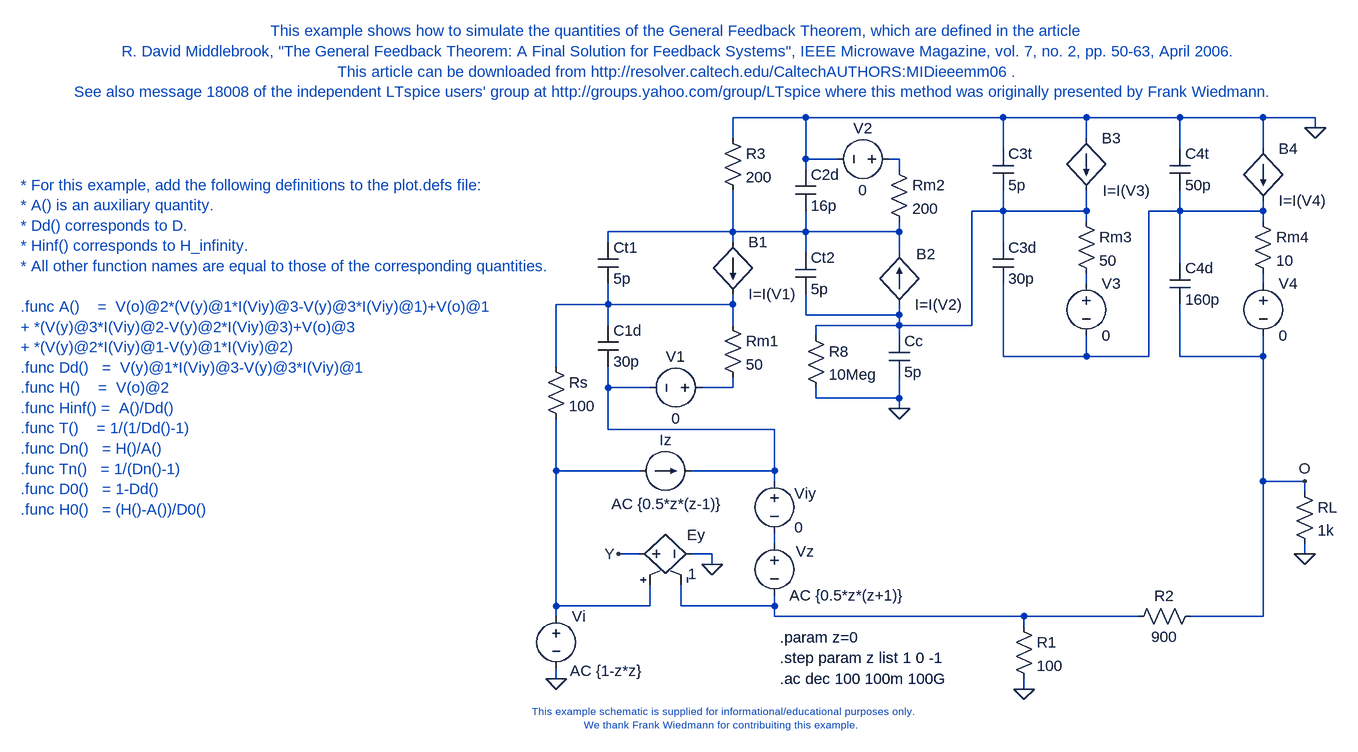
[diagram p0: schematic GFT2.asc]
GFT2.asc, the LTspice schematic file:
Version 4
SHEET 1 2208 680
WIRE 272 -848 160 -848
WIRE 576 -848 272 -848
WIRE 704 -848 576 -848
WIRE 848 -848 704 -848
WIRE 976 -848 848 -848
WIRE 1056 -848 976 -848
WIRE 1056 -832 1056 -848
WIRE 160 -816 160 -848
WIRE 704 -816 704 -848
WIRE 576 -800 576 -848
WIRE 848 -800 848 -848
WIRE 976 -800 976 -848
WIRE 272 -784 272 -848
WIRE 320 -784 272 -784
WIRE 416 -784 400 -784
WIRE 272 -768 272 -784
WIRE 416 -768 416 -784
WIRE 576 -704 576 -736
WIRE 576 -704 528 -704
WIRE 704 -704 704 -736
WIRE 704 -704 576 -704
WIRE 848 -704 848 -736
WIRE 848 -704 800 -704
WIRE 976 -704 976 -720
WIRE 976 -704 848 -704
WIRE 704 -688 704 -704
WIRE 976 -688 976 -704
WIRE 160 -672 160 -736
WIRE 160 -672 -32 -672
WIRE 272 -672 272 -704
WIRE 272 -672 160 -672
WIRE 416 -672 416 -688
WIRE 416 -672 272 -672
WIRE -32 -656 -32 -672
WIRE 160 -656 160 -672
WIRE 576 -656 576 -704
WIRE 272 -640 272 -672
WIRE 416 -640 416 -672
WIRE 848 -624 848 -704
WIRE 704 -592 704 -608
WIRE 976 -592 976 -608
WIRE -32 -560 -32 -592
WIRE -32 -560 -112 -560
WIRE 160 -560 160 -576
WIRE 160 -560 -32 -560
WIRE 272 -544 272 -576
WIRE 416 -544 416 -560
WIRE 416 -544 272 -544
WIRE -32 -528 -32 -560
WIRE 160 -528 160 -560
WIRE 416 -528 416 -544
WIRE 416 -528 288 -528
WIRE 528 -528 528 -704
WIRE 528 -528 416 -528
WIRE 288 -512 288 -528
WIRE 416 -512 416 -528
WIRE 576 -480 576 -592
WIRE 704 -480 704 -512
WIRE 704 -480 576 -480
WIRE 800 -480 800 -704
WIRE 800 -480 704 -480
WIRE 848 -480 848 -560
WIRE 976 -480 976 -512
WIRE 976 -480 848 -480
WIRE -112 -464 -112 -560
WIRE -32 -432 -32 -464
WIRE 32 -432 -32 -432
WIRE 160 -432 160 -448
WIRE 160 -432 112 -432
WIRE 288 -416 288 -432
WIRE 416 -416 416 -448
WIRE 416 -416 288 -416
WIRE 416 -400 416 -416
WIRE -32 -368 -32 -432
WIRE 224 -368 -32 -368
WIRE -112 -304 -112 -384
WIRE 16 -304 -112 -304
WIRE 224 -304 224 -368
WIRE 224 -304 96 -304
WIRE 224 -288 224 -304
WIRE 976 -288 976 -480
WIRE 1040 -288 976 -288
WIRE 1040 -272 1040 -288
WIRE 224 -192 224 -208
WIRE 16 -176 -16 -176
WIRE 128 -176 96 -176
WIRE 1040 -176 1040 -192
WIRE 128 -160 128 -176
WIRE -112 -96 -112 -304
WIRE 32 -96 32 -128
WIRE 32 -96 -112 -96
WIRE 80 -96 80 -128
WIRE 224 -96 224 -112
WIRE 224 -96 80 -96
WIRE -112 -80 -112 -96
WIRE 224 -80 224 -96
WIRE 608 -80 224 -80
WIRE 784 -80 608 -80
WIRE 976 -80 976 -288
WIRE 976 -80 864 -80
WIRE 608 -64 608 -80
WIRE -112 16 -112 0
WIRE 608 32 608 16
FLAG -112 16 0
FLAG 128 -160 0
FLAG -16 -176 Y
FLAG 416 -400 0
FLAG 1056 -832 0
FLAG 608 32 0
FLAG 1040 -176 0
FLAG 1040 -288 O
SYMBOL voltage -112 -96 R0
WINDOW 123 21 100 Left 2
WINDOW 39 0 0 Left 2
SYMATTR Value2 AC {1-z*z}
SYMATTR InstName Vi
SYMATTR Value ""
SYMBOL current 16 -304 R270
WINDOW 0 32 40 VTop 2
WINDOW 3 -32 40 VBottom 2
WINDOW 123 -35 42 VBottom 2
WINDOW 39 0 0 Left 2
SYMATTR InstName Iz
SYMATTR Value ""
SYMATTR Value2 AC {0.5*z*(z-1)}
SYMBOL voltage 224 -304 R0
WINDOW 123 0 0 Left 2
WINDOW 39 0 0 Left 2
WINDOW 3 31 87 Left 2
WINDOW 0 31 35 Left 2
SYMATTR Value 0
SYMATTR InstName Viy
SYMBOL voltage 224 -208 R0
WINDOW 123 23 96 Left 2
WINDOW 39 0 0 Left 2
WINDOW 0 33 28 Left 2
SYMATTR Value2 AC {0.5*z*(z+1)}
SYMATTR InstName Vz
SYMATTR Value ""
SYMBOL e 0 -176 R270
WINDOW 0 29 89 VRight 2
WINDOW 3 -31 91 VRight 2
SYMATTR InstName Ey
SYMATTR Value 1
SYMBOL res -128 -480 R0
SYMATTR InstName Rs
SYMATTR Value 100
SYMBOL voltage 128 -432 R90
WINDOW 0 -32 56 VBottom 2
WINDOW 3 32 56 VTop 2
WINDOW 123 32 56 VTop 2
WINDOW 39 32 56 VTop 2
SYMATTR InstName V1
SYMATTR Value 0
SYMBOL cap -48 -528 R0
SYMATTR InstName C1d
SYMATTR Value 30p
SYMBOL res 144 -544 R0
SYMATTR InstName Rm1
SYMATTR Value 50
SYMBOL cap -48 -656 R0
SYMATTR InstName Ct1
SYMATTR Value 5p
SYMBOL bi 160 -656 R0
SYMATTR InstName B1
SYMATTR Value I=I(V1)
SYMBOL res 144 -832 R0
SYMATTR InstName R3
SYMATTR Value 200
SYMBOL cap 256 -768 R0
SYMATTR InstName C2d
SYMATTR Value 16p
SYMBOL voltage 416 -784 R90
WINDOW 0 -32 56 VBottom 2
WINDOW 3 32 56 VTop 2
WINDOW 123 32 56 VTop 2
WINDOW 39 32 56 VTop 2
SYMATTR InstName V2
SYMATTR Value 0
SYMBOL res 400 -784 R0
SYMATTR InstName Rm2
SYMATTR Value 200
SYMBOL cap 256 -640 R0
SYMATTR InstName Ct2
SYMATTR Value 5p
SYMBOL bi 416 -560 M180
WINDOW 0 26 78 Left 2
WINDOW 3 24 0 Left 2
SYMATTR InstName B2
SYMATTR Value I=I(V2)
SYMBOL cap 400 -512 R0
SYMATTR InstName Cc
SYMATTR Value 5p
SYMBOL res 272 -528 R0
SYMATTR InstName R8
SYMATTR Value 10Meg
SYMBOL cap 560 -800 R0
SYMATTR InstName C3t
SYMATTR Value 5p
SYMBOL bi 704 -816 R0
WINDOW 3 25 81 Left 2
SYMATTR Value I=I(V3)
SYMATTR InstName B3
SYMBOL cap 560 -656 R0
SYMATTR InstName C3d
SYMATTR Value 30p
SYMBOL res 688 -704 R0
SYMATTR InstName Rm3
SYMATTR Value 50
SYMBOL voltage 704 -608 R0
WINDOW 123 0 0 Left 2
WINDOW 39 0 0 Left 2
SYMATTR Value 0
SYMATTR InstName V3
SYMBOL cap 832 -800 R0
SYMATTR InstName C4t
SYMATTR Value 50p
SYMBOL bi 976 -800 R0
SYMATTR InstName B4
SYMATTR Value I=I(V4)
SYMBOL cap 832 -624 R0
SYMATTR InstName C4d
SYMATTR Value 160p
SYMBOL res 960 -704 R0
SYMATTR InstName Rm4
SYMATTR Value 10
SYMBOL voltage 976 -608 R0
WINDOW 123 0 0 Left 2
WINDOW 39 0 0 Left 2
SYMATTR Value 0
SYMATTR InstName V4
SYMBOL res 592 -80 R0
SYMATTR InstName R1
SYMATTR Value 100
SYMBOL res 880 -96 R90
WINDOW 0 0 56 VBottom 2
WINDOW 3 32 56 VTop 2
SYMATTR InstName R2
SYMATTR Value 900
SYMBOL res 1024 -288 R0
SYMATTR InstName RL
SYMATTR Value 1k
TEXT 232 16 Left 2 !.ac dec 100 100m 100G
TEXT 232 -48 Left 2 !.param z=0
TEXT 232 -16 Left 2 !.step param z list 1 0 -1
TEXT 136 56 Top 1 ;This example schematic is supplied for informational/educational purposes only.\nWe thank Frank Wiedmann for contribuiting this example.
TEXT 80 -872 Bottom 2 ;This example shows how to simulate the quantities of the General Feedback Theorem, which are defined in the article\n R. David Middlebrook, "The General Feedback Theorem: A Final Solution for Feedback Systems", IEEE Microwave Magazine, vol. 7, no. 2, pp. 50-63, April 2006.\nThis article can be downloaded from http://resolver.caltech.edu/CaltechAUTHORS:MIDieeemm06 .\nSee also message 18008 of the independent LTspice users' group at http://groups.yahoo.com/group/LTspice where this method was originally presented by Frank Wiedmann.
TEXT -936 -744 Left 2 ;* For this example, add the following definitions to the plot.defs file:\n* A() is an auxiliary quantity.\n* Dd() corresponds to D.\n* Hinf() corresponds to H_infinity.\n* All other function names are equal to those of the corresponding quantities.\n \n.func A()    =  V(o)@2*(V(y)@1*I(Viy)@3-V(y)@3*I(Viy)@1)+V(o)@1\n+ *(V(y)@3*I(Viy)@2-V(y)@2*I(Viy)@3)+V(o)@3\n+ *(V(y)@2*I(Viy)@1-V(y)@1*I(Viy)@2)\n.func Dd()   =  V(y)@1*I(Viy)@3-V(y)@3*I(Viy)@1\n.func H()    =  V(o)@2\n.func Hinf() =  A()/Dd()\n.func T()    = 1/(1/Dd()-1)\n.func Dn()   = H()/A()\n.func Tn()   = 1/(Dn()-1)\n.func D0()   = 1-Dd()\n.func H0()   = (H()-A())/D0()

The netlist it stands for:
* GFT2.asc
Vi N010 0 AC {1-z*z}
Iz N010 N008 AC {0.5*z*(z-1)}
Viy N008 N011 0
Vz N011 N012 AC {0.5*z*(z+1)}
Ey Y 0 N010 N012 1
Rs N007 N010 100
V1 N009 N008 0
C1d N007 N008 30p
Rm1 N007 N009 50
Ct1 N004 N007 5p
B1 N004 N007 I=I(V1)
R3 0 N004 200
C2d 0 N004 16p
V2 N001 0 0
Rm2 N001 N004 200
Ct2 N004 N002 5p
B2 N002 N004 I=I(V2)
Cc N002 0 5p
R8 N002 0 10Meg
C3t 0 N002 5p
B3 0 N002 I=I(V3)
C3d N002 N003 30p
Rm3 N002 N005 50
V3 N005 N003 0
C4t 0 N003 50p
B4 0 N003 I=I(V4)
C4d N003 O 160p
Rm4 N003 N006 10
V4 N006 O 0
R1 N012 0 100
R2 O N012 900
RL O 0 1k
.ac dec 100 100m 100G
.param z=0
.step param z list 1 0 -1
* This example schematic is supplied for informational/educational purposes only.
* We thank Frank Wiedmann for contribuiting this example.
* This example shows how to simulate the quantities of the General Feedback Theorem, which are defined in the article
*  R. David Middlebrook, "The General Feedback Theorem: A Final Solution for Feedback Systems", IEEE Microwave Magazine, vol. 7, no. 2, pp. 50-63, April 2006.
* This article can be downloaded from http://resolver.caltech.edu/CaltechAUTHORS:MIDieeemm06 .
* See also message 18008 of the independent LTspice users' group at http://groups.yahoo.com/group/LTspice where this method was originally presented by Frank Wiedmann.
* * For this example, add the following definitions to the plot.defs file:
* * A() is an auxiliary quantity.
* * Dd() corresponds to D.
* * Hinf() corresponds to H_infinity.
* * All other function names are equal to those of the corresponding quantities.
* .func A()    =  V(o)@2*(V(y)@1*I(Viy)@3-V(y)@3*I(Viy)@1)+V(o)@1
* + *(V(y)@3*I(Viy)@2-V(y)@2*I(Viy)@3)+V(o)@3
* + *(V(y)@2*I(Viy)@1-V(y)@1*I(Viy)@2)
* .func Dd()   =  V(y)@1*I(Viy)@3-V(y)@3*I(Viy)@1
* .func H()    =  V(o)@2
* .func Hinf() =  A()/Dd()
* .func T()    = 1/(1/Dd()-1)
* .func Dn()   = H()/A()
* .func Tn()   = 1/(Dn()-1)
* .func D0()   = 1-Dd()
* .func H0()   = (H()-A())/D0()
.backanno
.end